# EAGLE design orp_adc_iso (EAGLE 6.2)
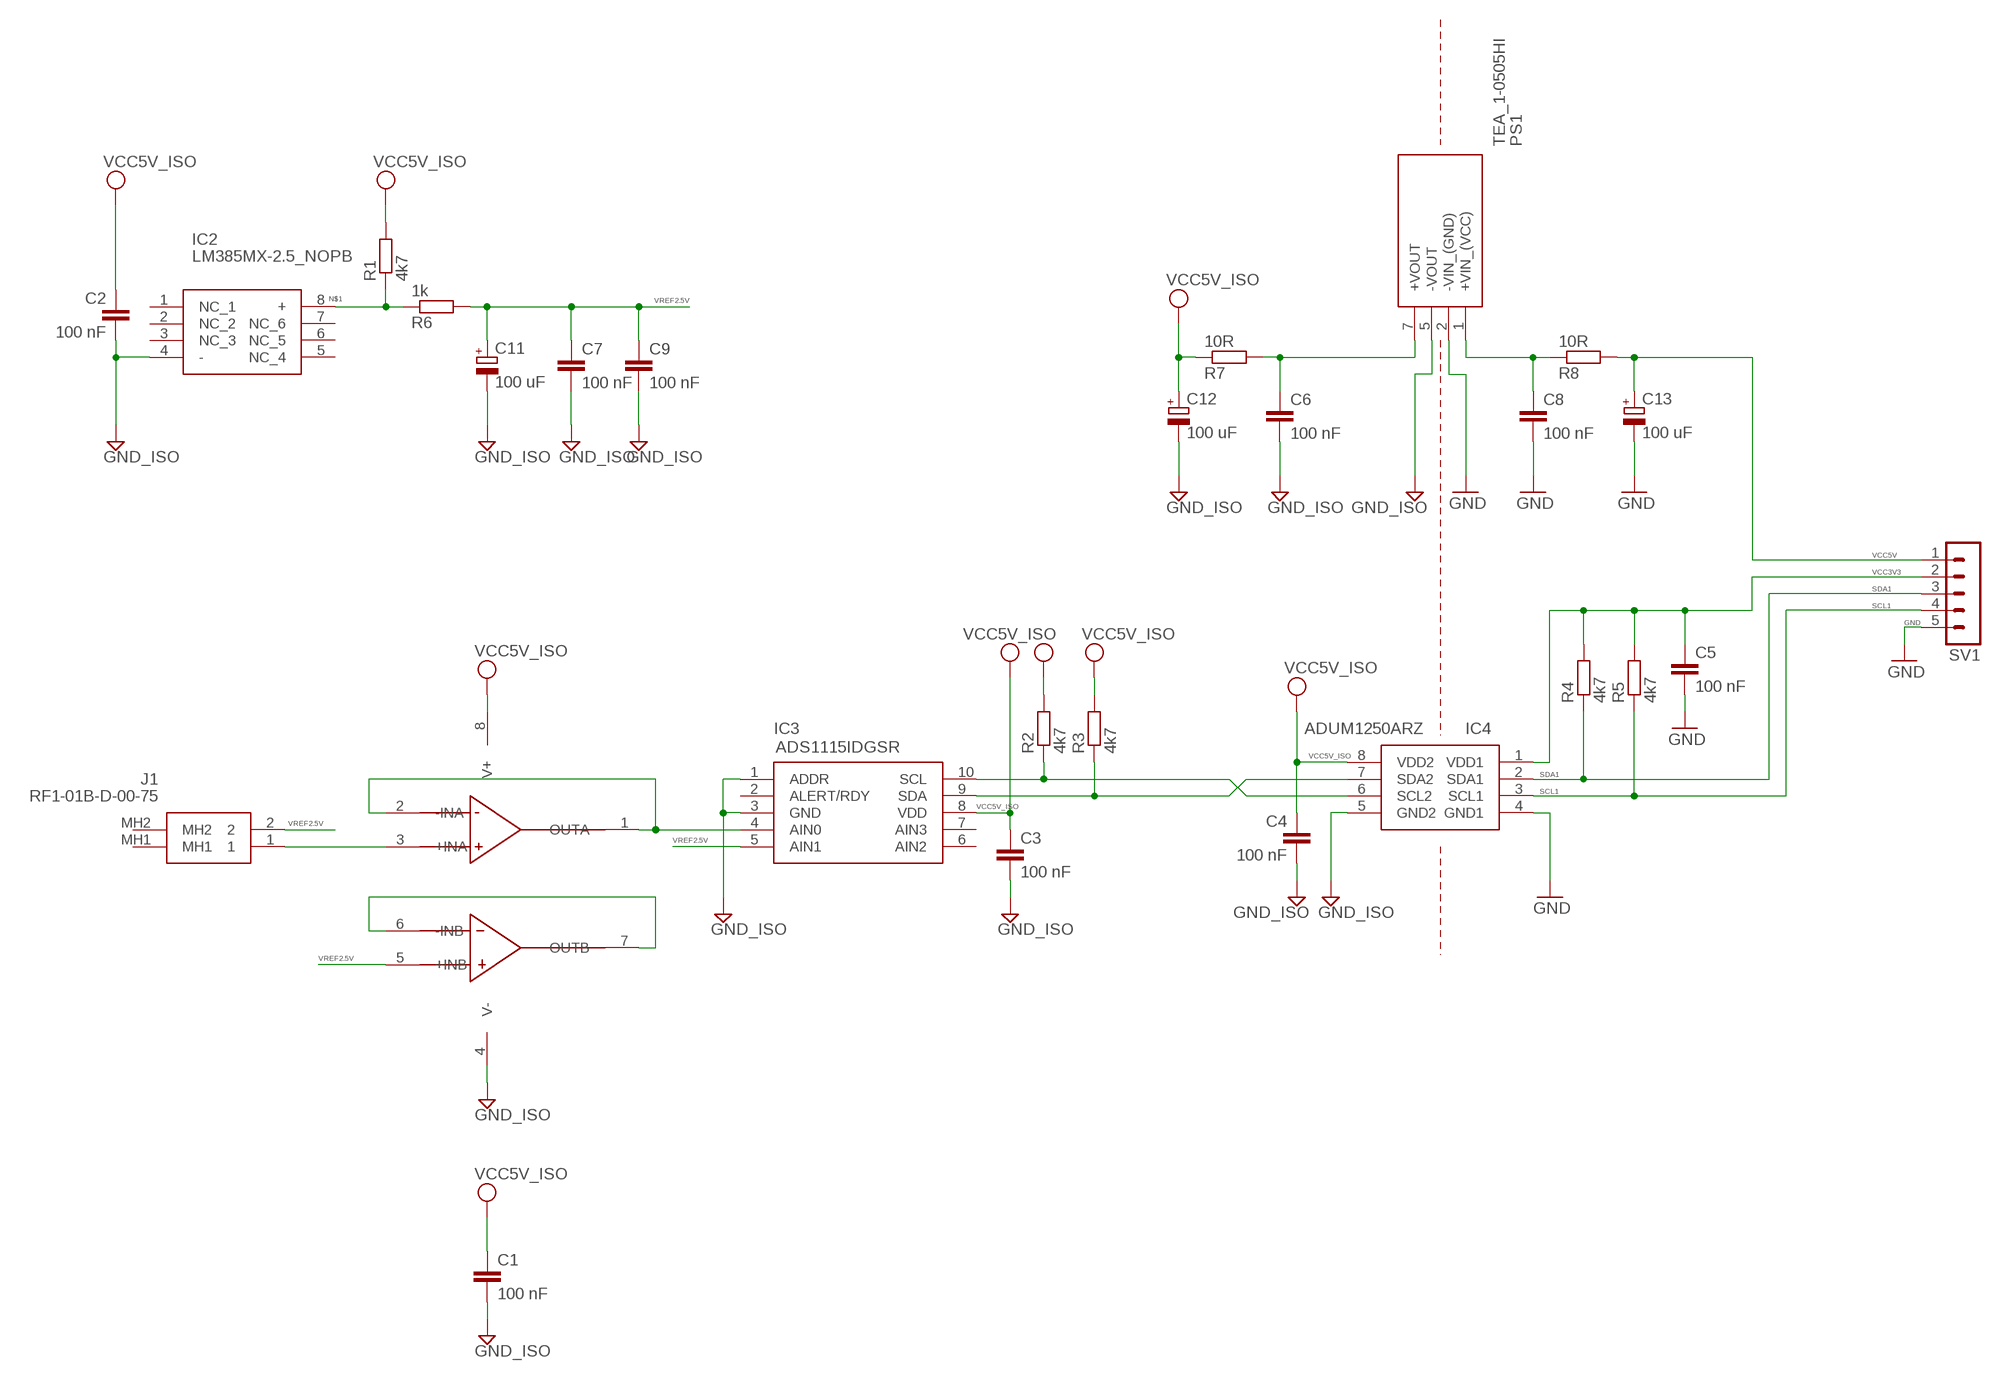
[diagram p0: schematic, sheet 1]

## Parts
C1  100 nF  C-EUC0603  [C0603]
C2  100 nF  C-EUC0603  [C0603]
C3  100 nF  C-EUC0603  [C0603]
C4  100 nF  C-EUC0603  [C0603]
C5  100 nF  C-EUC0603  [C0603]
C6  100 nF  C-EUC0603  [C0603]
C7  100 nF  C-EUC0603  [C0603]
C8  100 nF  C-EUC0603  [C0603]
C9  100 nF  C-EUC0603  [C0603]
C11  100 uF  CPOL-EUSMCC  [SMC_C]
C12  100 uF  CPOL-EUSMCC  [SMC_C]
C13  100 uF  CPOL-EUSMCC  [SMC_C]
IC2  LM385MX-2.5_NOPB  [SOIC127P600X175-8N]
IC3  ADS1115IDGSR  [SOP50P490X110-10N]
IC4  ADUM1250ARZ  [SOIC127P600X175-8N]
J1  RF1-01B-D-00-75  [RF101BD0075]
PS1  TEA_1-0505HI  [TEA10505HI]
R1  4k7  R-EU_R0603  [R0603]
R2  4k7  R-EU_R0603  [R0603]
R3  4k7  R-EU_R0603  [R0603]
R4  4k7  R-EU_R0603  [R0603]
R5  4k7  R-EU_R0603  [R0603]
R6  1k  R-EU_R0603  [R0603]
R7  10R  R-EU_R0603  [R0603]
R8  10R  R-EU_R0603  [R0603]
SV1  MA05-1  [MA05-1]
U$1  LMC6482AIMX/NOPB  [SO8]

## Nets
GND: C5.2 C8.2 C13.- IC4.4(GND1) PS1.2(-VIN_(GND)) SV1.5
GND_ISO: C1.2 C2.2 C3.2 C4.2 C6.2 C7.2 C9.2 C11.- C12.- IC2.4(-) IC3.1(ADDR) IC3.3(GND) IC4.5(GND2) PS1.5(-VOUT) U$1.4(V-)
N$1: IC2.8(+) R1.1 R6.1
N$2: J1.1 U$1.3(+INA)
N$3: IC3.4(AIN0) U$1.1(OUTA) U$1.2(-INA)
N$4: U$1.6(-INB) U$1.7(OUTB)
N$9: IC3.9(SDA) IC4.7(SDA2) R3.1
N$10: IC3.10(SCL) IC4.6(SCL2) R2.1
SCL1: IC4.3(SCL1) R5.1 SV1.4
SDA1: IC4.2(SDA1) R4.1 SV1.3
VCC3V3: C5.1 IC4.1(VDD1) R4.2 R5.2 SV1.2
VCC5V: C13.+ R8.2 SV1.1
VCC5V_INTERNAL: C8.1 PS1.1(+VIN_(VCC)) R8.1
VCC5V_ISO: C1.1 C2.1 C3.1 C4.1 C12.+ IC3.8(VDD) IC4.8(VDD2) R1.2 R2.2 R3.2 R7.1 U$1.8(V+)
VCC5V_ISO_INTERNAL: C6.1 PS1.7(+VOUT) R7.2
VREF2.5V: C7.1 C9.1 C11.+ IC3.5(AIN1) J1.2 R6.2 U$1.5(+INB)
Unconnected: IC2.1(NC_1) IC2.2(NC_2) IC2.3(NC_3) IC2.5(NC_4) IC2.6(NC_5) IC2.7(NC_6) IC3.2(ALERT/RDY) IC3.6(AIN2) IC3.7(AIN3) J1.MH1 J1.MH2

## Library data of the parts
C1-C9 = rcl:C-EU: CAPACITOR, European symbol
C11-C13 = rcl:CPOL-EU: POLARIZED CAPACITOR, European symbol
IC2 = LM385MX-2.5_NOPB:LM385MX-2.5_NOPB: Micropower Voltage Reference Diode Source: Datasheet <http://www.ti.com/lit/gpn/lm385-2.5-n>; DESCRIPTION: Micropower Voltage Reference Diode; HEIGHT: 1.75mm; MANUFACTURER_NAME: Texas Instruments; MANUFACTURER_PART_NUMBER: LM385MX-2.5/NOPB
IC3 = ADS1115IDGSR:ADS1115IDGSR: 16-Bit 860SPS 4-Ch Delta-Sigma ADC With PGA, Oscillator, Vref, Comparator, and I2C Source: Datasheet <http://www.ti.com/lit/gpn/ADS1115>; DESCRIPTION: 16-Bit 860SPS 4-Ch Delta-Sigma ADC With PGA, Oscillator, Vref, Comparator, and I2C; HEIGHT: 1.1mm; MANUFACTURER_NAME: Texas Instruments; MANUFACTURER_PART_NUMBER: ADS1115IDGSR
IC4 = ADUM1250ARZ:ADUM1250ARZ: Hot Swappable Dual I2C Isolator Source: Datasheet <https://www.analog.com/ADUM1250/datasheet>; DESCRIPTION: Hot Swappable Dual I2C Isolator; HEIGHT: 1.75mm; MANUFACTURER_NAME: Analog Devices; MANUFACTURER_PART_NUMBER: ADUM1250ARZ
J1 = RF1-01B-D-00-75:RF1-01B-D-00-75: Socket; BNC; female; insulated; angled 90; 75; THT; POM Source: Datasheet <https://app.adam-tech.com/products/download/data_sheet/198033/rf1-01b-d-00-75-data-sheet.pdf>; DESCRIPTION: Socket; BNC; female; insulated; angled 90; 75; THT; POM; HEIGHT: 16.1798mm; MANUFACTURER_NAME: Adam Tech; MANUFACTURER_PART_NUMBER: RF1-01B-D-00-75
PS1 = TEA_1-0505HI:TEA_1-0505HI: 1 Watt DC/DC converter, industrial, +/-10% input, unregulated, 4000 VDC isolation, highly cost efficient, encapsulated, SIP-7 Source: Datasheet <https://tracopower.com/tea1hi-datasheet/>; DESCRIPTION: 1 Watt DC/DC converter, industrial, +/-10% input, unregulated, 4000 VDC isolation, highly cost efficient, encapsulated, SIP-7; HEIGHT: 10.35mm; MANUFACTURER_NAME: Traco Power; MANUFACTURER_PART_NUMBER: TEA 1-0505HI
R1-R8 = rcl:R-EU_: RESISTOR, European symbol
SV1 = con-lstb:MA05-1: PIN HEADER; OC_FARNELL: unknown; OC_NEWARK: unknown
U$1 = other:LMC6482AIMX/NOPB

## Board
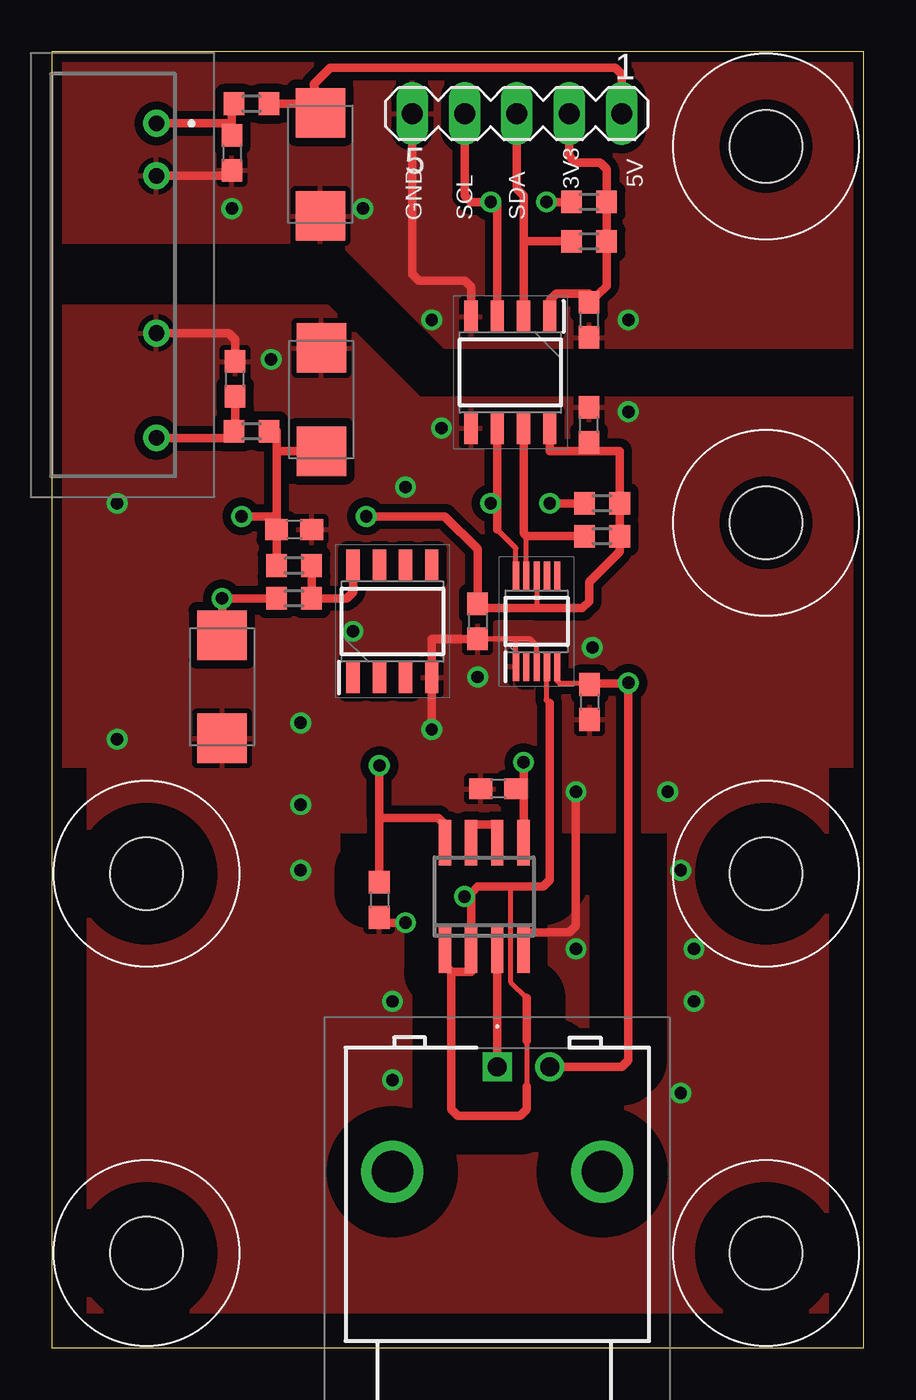
[diagram p1: board, top side]
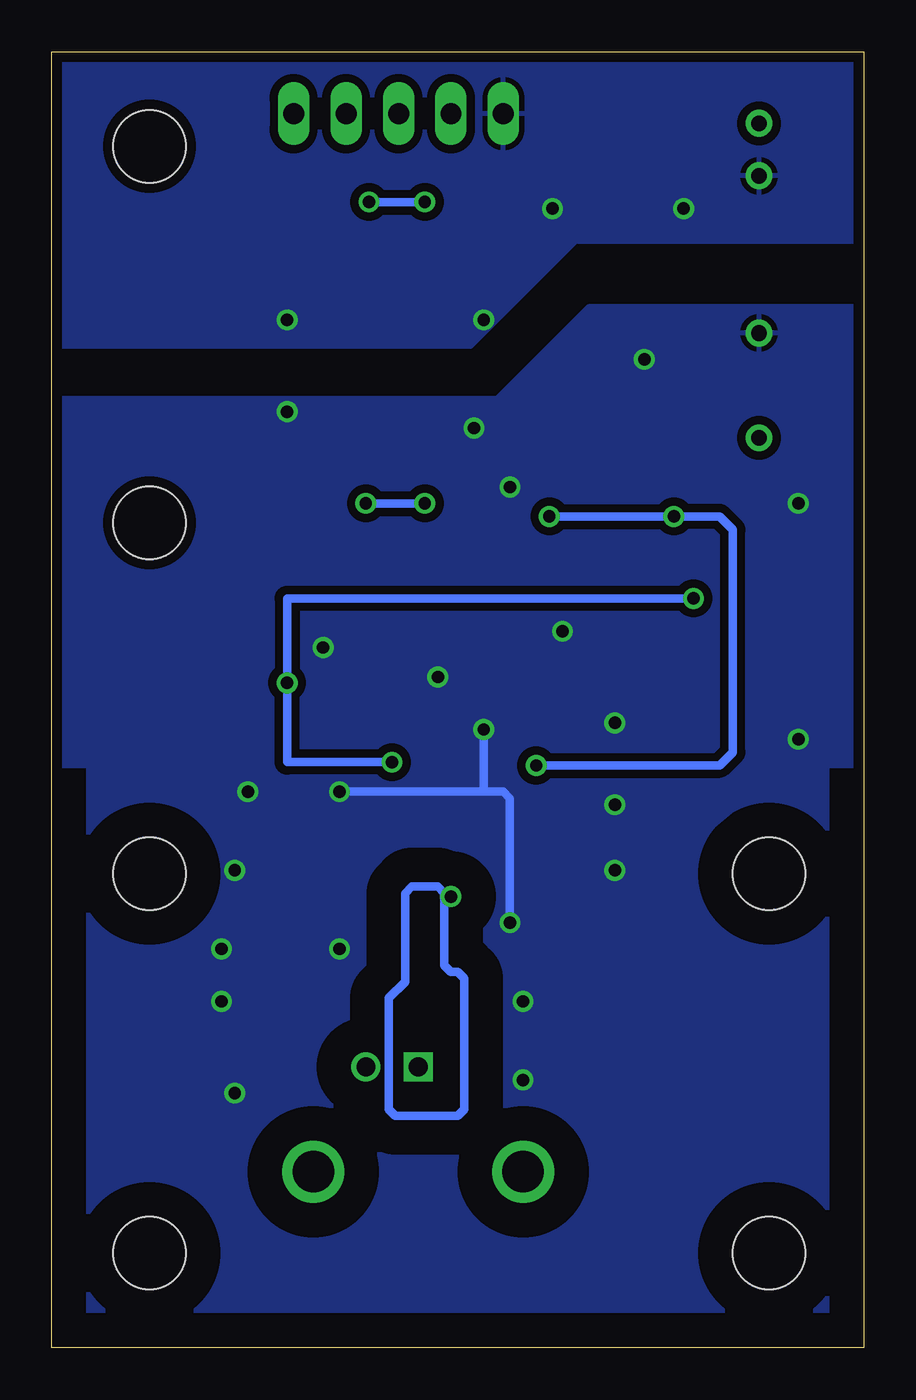
[diagram p2: board, bottom side, seen from below]

Size 39.35 x 62.82 mm. Coordinates in mm from the lower left corner, seen from the top.
Outline: 0,0 39.35,0 39.35,62.82 0,62.82 0,0
Copper layers (1*16): Top 0.035mm / dielectric 1.5mm / Bottom 0.035mm
Design rules: minimum track width 0.2mm, minimum drill 0.5mm, track to track 0.2mm, track to pad 0.2mm, pad to pad 0.2mm, via to via 0.2mm, smd to smd 0.2mm, copper to edge 0.5mm, drill to drill 8mil, minimum pad ring 10mil, minimum via ring 8mil, stop-mask expansion 4mil, vias tented up to drill 0mil, thermal gap 10mil
Holes 3.5 mm at 34.61,22.99 4.6,4.6 34.61,4.6 34.61,58.23 4.6,22.99 34.61,39.99

### Footprints (pad centres in the part's own frame; a part is rotated, then mirrored left to right if it is on the bottom)
C0603 = smd 1.1 x 1: 1 -0.85,0; 2 0.85,0
SMC_C = smd 2.4 x 2.4: + -2.5,0; - 2.5,0
SOIC127P600X175-8N = smd 1.528 x 0.65: 1 -2.711,1.905; 2 -2.711,0.635; 3 -2.711,-0.635; 4 -2.711,-1.905; 5 2.711,-1.905; 6 2.711,-0.635; 7 2.711,0.635; 8 2.711,1.905
SOP50P490X110-10N = smd 1.4 x 0.3: 1 -2.2,1; 2 -2.2,0.5; 3 -2.2,0; 4 -2.2,-0.5; 5 -2.2,-1; 6 2.2,-1; 7 2.2,-0.5; 8 2.2,0; 9 2.2,0.5; 10 2.2,1
SOIC127P600X175-8N' = smd 1.525 x 0.65: 1 -2.712,1.905; 2 -2.712,0.635; 3 -2.712,-0.635; 4 -2.712,-1.905; 5 2.712,-1.905; 6 2.712,-0.635; 7 2.712,0.635; 8 2.712,1.905
RF101BD0075 = drill 0.9 pad 1.4 square: 1 0,0 | drill 0.9 pad 1.4: 2 -2.54,0 | drill 2 pad 3: MH1 5.08,5.08; MH2 -5.08,5.08
TEA10505HI = drill 0.76 pad 1.303: 1 0,0; 2 2.54,0; 5 10.16,0; 7 15.24,0
R0603 = smd 1 x 1.1: 1 -0.85,0; 2 0.85,0
MA05-1 = drill 1.016 long: 1 -5.08,0; 2 -2.54,0; 3 0,0; 4 2.54,0; 5 5.08,0
SO8 = smd 0.6 x 2.2: 1 -1.905,-2.6; 2 -0.635,-2.6; 3 0.635,-2.6; 4 1.905,-2.6; 5 1.905,2.6; 6 0.635,2.6; 7 -0.635,2.6; 8 -1.905,2.6

### Placement (x,y rotation side)
C1  15.88,21.72 270 top
C2  11.75,39.66 0 top
C3  20.64,35.21 270 top
C4  26.04,44.73 90 top
C5  26.04,49.81 270 top
C6  8.89,46.96 90 top
C7  26.06,31.3 270 top
C8  8.73,57.91 270 top
C9  21.64,27.1 180 top
C11  8.25,32.03 270 top
C12  13.06,45.96 90 top
C13  13.02,57.36 270 top
IC2  16.51,35.21 90 top
IC3  23.5,35.21 90 top
IC4  ADUM1250ARZ  [SOIC127P600X175-8N']  22.23,47.27 270 top
J1  21.59,13.62 180 top
PS1  5.08,59.34 270 top
R1  11.75,37.91 180 top
R2  26.67,40.92 0 top
R3  26.67,39.34 0 top
R4  26.04,53.62 0 top
R5  26.04,55.53 0 top
R6  11.75,36.32 180 top
R7  9.68,44.42 180 top
R8  9.68,60.29 0 top
SV1  22.54,59.82 180 top
U$1  20.96,21.88 0 top

### Tracks (layer width: path | path; a pad name or v marks a point on that pad's centre or on a via)
GND  (via drill 0.6)
  Top 0.406: PS1.2 8.73,56.8 C8.2 | IC4.4 20.32,51.4 20,51.72 17.78,51.72 17.46,52.04 SV1.5
  other vias: 27.94,49.81 18.42,49.81 15.08,55.21 8.73,55.21
  pour Top (isolate 0.406): 0,53.62 13.97,53.62 19.05,48.55 39.37,48.55 39.37,63.15 0,63.15
  pour Bottom (isolate 0.406): 0,53.62 0,63.15 39.37,63.15 39.37,48.55 19.05,48.55 13.97,53.62
GND_ISO  (via drill 0.6)
  Top 0.254: IC3.3 23.5,34.04 23.18,34.36 22.5,34.36 | 22.5,34.36 C3.2 | IC3.1 22.5,34.36
  Top 0.406: PS1.5 8.57,49.18 8.89,48.86 C6.2 | C3.2 18.42,34.36 IC2.4 v18.42,29.97 | U$1.4 22.86,20.13 25.08,20.13 25.4,20.45 v25.4,26.95 | v17.14,20.61 15.88,20.61 C1.2
  Bottom 0.406: v25.4,26.95 18.42,26.95 | 18.42,26.95 17.46,26.95 17.14,26.64 v17.14,20.61 | v18.42,29.97 18.42,26.95
  other vias: 27.94,45.37 10.64,47.91 17.14,41.72 26.19,33.94 20.64,32.51 14.6,34.73 18.89,44.58 12.06,30.29 25.4,19.34 16.51,16.8 12.06,26.32 31.12,16.8 31.12,19.34 29.85,26.95 16.51,12.98 30.48,12.35 12.06,23.14 30.48,23.14 3.18,29.5 3.18,40.92
  pour Bottom (isolate 0.406): 0,28.23 0,50.45 13.33,50.45 17.78,46.01 39.37,46.01 39.37,28.23 33.02,28.23 30.48,25.05 7.62,25.05 3.81,28.23
  pour Top (isolate 0.406, rank 2): 0,50.45 13.33,50.45 17.78,46.01 39.37,46.01 39.37,28.23 30.48,28.23 30.48,25.05 9.52,25.05 9.52,28.23 0,28.23
  pour Top (isolate 1.676): 0,28.23 0,0 39.37,0 39.37,28.23
  pour Bottom (isolate 1.676): 0,28.23 0,0 39.37,0 39.37,28.23
N$1
  Top 0.406: R1.1 R6.1 14.29,36.32 14.6,36.64 IC2.8
N$2
  Top 0.406: U$1.3 J1.1
N$3  (via drill 0.6)
  Top 0.254: 24,31.4 IC3.4 | 22.23,22.35 22.23,17.75 23.02,16.95 | 23.02,14.89 23.02,12.67
  Top 0.305: 24.13,31.24 24,31.4
  Top 0.406: 19.37,18.22 20.32,18.22 U$1.2 20.32,21.88 | 19.37,18.22 19.05,18.54 U$1.1 | 20.32,21.88 20.32,22.03 20.64,22.35 22.23,22.35 23.81,22.35 24.13,22.67 24.13,31.24 | 23.02,12.67 23.02,11.56 22.7,11.24 19.69,11.24 19.37,11.56 19.37,18.22 | 23.02,16.95 23.02,14.89 | 20.32,21.88 v20,21.88
  Bottom 0.406: v20,21.88 20.32,21.88 | 20.32,21.88 20.32,18.54 20,18.22 19.69,18.22 19.37,17.91 19.37,11.56 19.69,11.24 22.7,11.24 23.02,11.56 23.02,16.95 22.23,17.75 22.23,22.03 21.91,22.35 20.64,22.35 20.32,22.03 20.32,21.88
N$4
  Top 0.406: U$1.7 20.32,25.37 21.59,25.37 U$1.6
N$9
  Top 0.254: IC3.9 23,39.34 23,39.36
  Top 0.406: 23,39.36 22.86,39.5 IC4.7 | R3.1 23,39.34
N$10  (via drill 0.6)
  Top 0.254: IC3.10 22.5,38.75 21.59,39.66 | v21.27,40.92 21.59,40.92
  Top 0.406: 21.59,39.66 21.59,40.92 IC4.6 | R2.1 v24.13,40.92
  Bottom 0.406: v24.13,40.92 v21.27,40.92
SCL1  (via drill 0.6)
  Top 0.406: SV1.4 20,55.85 20.32,55.53 v21.27,55.53 21.59,55.53 IC4.3 | R5.1 v23.97,55.53
  Bottom 0.406: v23.97,55.53 v21.27,55.53
SDA1
  Top 0.406: SV1.3 22.54,56.16 22.86,55.85 22.86,53.62 | 22.86,53.62 IC4.2 | R4.1 22.86,53.62
VCC3V3
  Top 0.406: SV1.2 25.08,57.75 25.4,57.44 26.57,57.44 26.89,57.12 R5.2 R4.2 26.89,51.46 C5.1 26.04,51.09 24.45,51.09 24.13,50.77 IC4.1
VCC5V
  Top 0.406: 10.53,60.31 R8.2 12.34,60.29 C13.+ 12.7,61.24 13.49,62.04 27.3,62.04 27.62,61.72 SV1.1
VCC5V_INTERNAL
  Top 0.406: PS1.1 8.73,59.34 C8.1 8.73,60.29 R8.1
VCC5V_ISO  (via drill 0.6)
  Top 0.254: IC3.8 23.5,35.84 | 20.64,35.84 C3.1
  Top 0.406: 10.53,44.4 R7.1 10.9,44.42 10.9,43.46 | IC4.8 24.13,43.47 26.04,43.47 | 26.04,43.47 C4.1 | 10.9,40.29 C2.1 R1.2 | 10.9,40.29 10.9,43.46 | 26.04,43.47 27.52,43.47 R2.2 R3.2 27.52,38.6 26.04,37.11 26.04,36.16 25.72,35.84 23.5,35.84 20.64,35.84 | C3.1 20.64,38.7 19.05,40.29 v15.24,40.29 | v9.21,40.29 10.9,40.29 | U$1.8 19.05,25.37 18.73,25.68 15.88,25.68 | 15.88,25.68 C1.1 | 15.88,25.68 v15.88,28.23 | C12.+ 10.9,43.46
  Bottom 0.406: v15.24,40.29 v9.21,40.29 6.99,40.29 6.35,39.66 6.35,28.86 6.99,28.23 v15.88,28.23
VCC5V_ISO_INTERNAL
  Top 0.406: PS1.7 8.83,44.1 R7.2 8.89,44.42 C6.1
VREF2.5V  (via drill 0.6)
  Top 0.254: IC3.5 24.5,32.3 24.61,32.19 26.04,32.19
  Top 0.406: R6.2 v8.25,36.32 C11.+ | J1.2 27.62,13.62 27.94,13.94 v27.94,32.23 27.94,32.19 26.04,32.19 26.04,32.15 C7.1 | U$1.5 22.86,27.1 | 22.86,27.1 v22.86,28.38 | C9.1 22.86,27.1
  Bottom 0.406: v8.25,36.32 27.94,36.32 v27.94,32.23 27.94,28.54 27.94,28.38 v22.86,28.38

### Text on the board
tNames: 3V3 | 5V | GND | SCL | SDA